# Altium project JlinkSwitch.PrjPcb
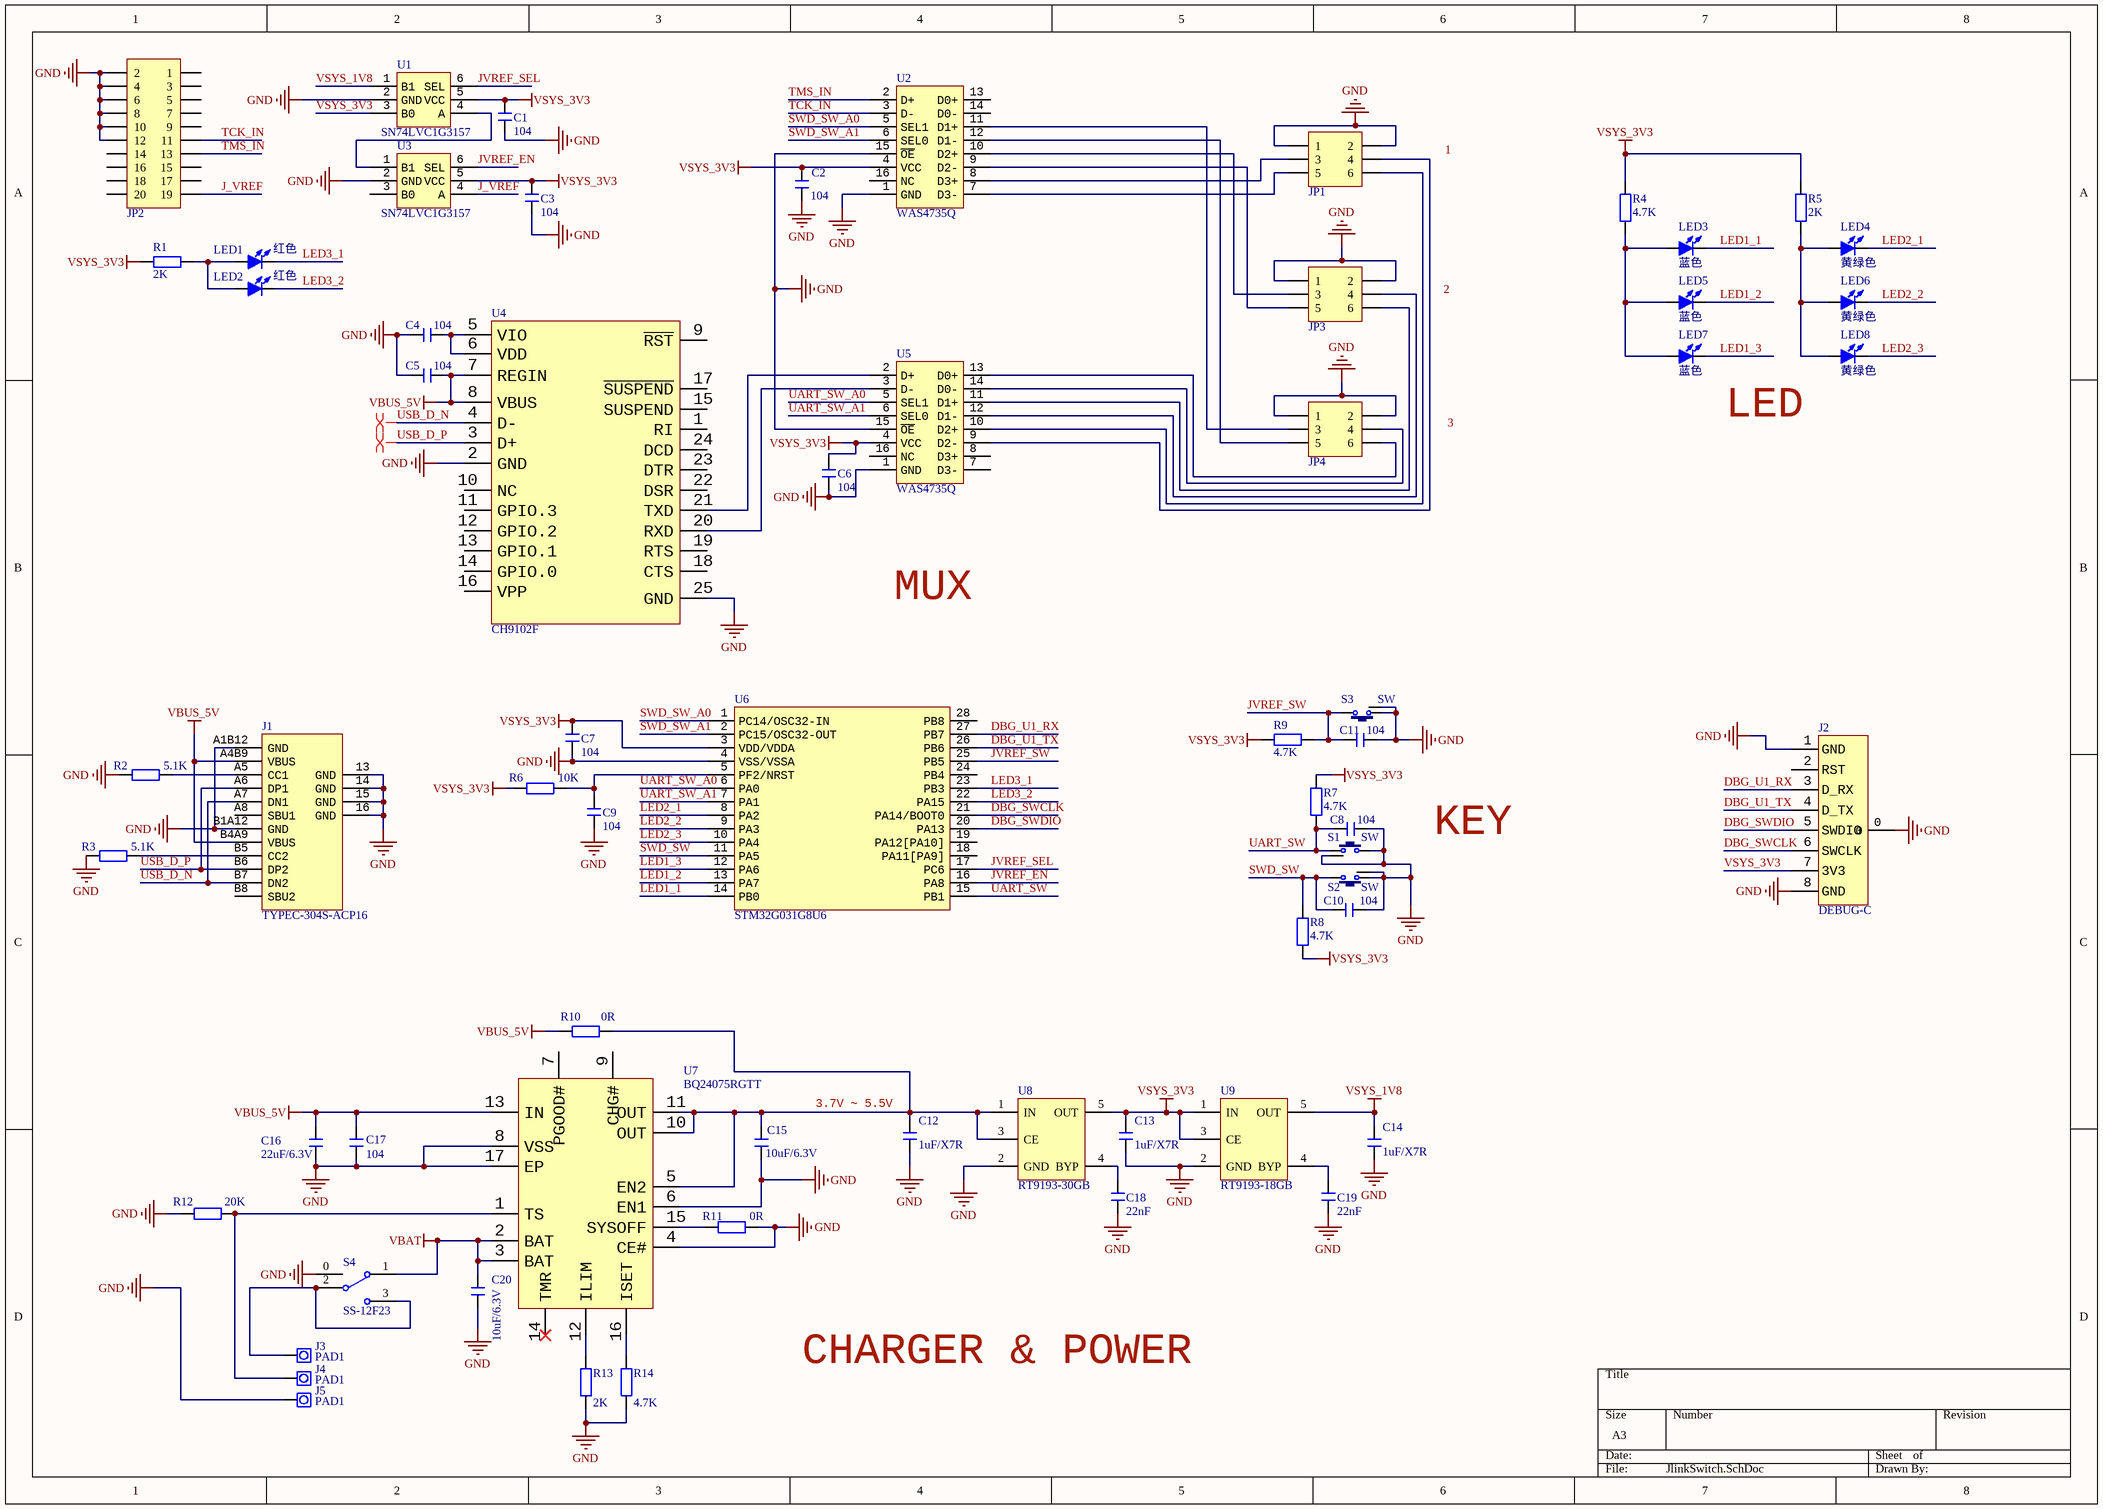
[diagram p0: JlinkSwitch.SchDoc]
1 sheet, 64 parts. Net scope: global (net labels, ports and power ports of the same name join across sheets).
Board file: JlinkSwitch.PcbDoc

## Sheet JlinkSwitch.SchDoc
size A3; SheetNumber: 1; SheetTotal: 1

### Parts
C1  104  [C 0402_L]
C2  104  [C 0402_L]
C3  104  [C 0402_L]
C4  104  [C 0402_L]
C5  104  [C 0402_L]
C6  104  [C 0402_L]
C7  104  [C 0402_L]
C8  104  [C 0402_L]
C9  104  [C 0402_L]
C10  104  [C 0402_L]
C11  104  [C 0402_L]
C12  1uF/X7R  [C 0402_L]
C13  1uF/X7R  [C 0402_L]
C14  1uF/X7R  [C 0402_L]
C15  10uF/6.3V  [C 0603_L]
C16  22uF/6.3V  [C 0603_L]
C17  104  [C 0402_L]
C18  22nF  [C 0402_L]
C19  22nF  [C 0402_L]
C20  10uF/6.3V  [C 0603_L]
J1  TYPEC-304S-ACP16  [USBC-16P-卧插]
J2  DEBUG-C  [FPC0.5 1H-WS-8P-NARROW]
J3  PAD1  [PAD]
J4  PAD1  [PAD]
J5  PAD1  [PAD]
JP1  Header3X2  [HDR2.54-LI-2X3P-侧贴]  (value not drawn)
JP2  Header 2X10  [HDR2.54-LI-M-2X10P-侧贴]  (value not drawn)
JP3  Header3X2  [HDR2.54-LI-2X3P-侧贴]  (value not drawn)
JP4  Header3X2  [HDR2.54-LI-2X3P-侧贴]  (value not drawn)
LED1  红色  [LED 0402R]
LED2  红色  [LED 0402R]
LED3  蓝色  [LED 0402R]
LED4  黄绿色  [LED 0402R]
LED5  蓝色  [LED 0402R]
LED6  黄绿色  [LED 0402R]
LED7  蓝色  [LED 0402R]
LED8  黄绿色  [LED 0402R]
R1  2K  [R 0402_L]
R2  5.1K  [R 0402_L]
R3  5.1K  [R 0402_L]
R4  4.7K  [R 0402_L]
R5  2K  [R 0402_L]
R6  10K  [R 0402_L]
R7  4.7K  [R 0402_L]
R8  4.7K  [R 0402_L]
R9  4.7K  [R 0402_L]
R10  0R  [R 0603_L]
R11  0R  [R 0402_L]
R12  20K  [R 0402_L]
R13  2K  [R 0402_L]
R14  4.7K  [R 0402_L]
S1  SW  [TS 2*4*3.5]
S2  SW  [TS 2*4*3.5]
S3  SW  [TS 2*4*3.5]
S4  SS-12F23  [MSK-12C01-07]
U1  SN74LVC1G3157  [SC70-6]
U2  WAS4735Q  [QFN16-1826]
U3  SN74LVC1G3157  [SC70-6]
U4  CH9102F  [QFN24 4x4_L]
U5  WAS4735Q  [QFN16-1826]
U6  STM32G031G8U6  [UFQFPN-28 4X4]
U7  BQ24075RGTT  [VQFN-16-EP(3X3)]
U8  RT9193-30GB  [SOT23-5]
U9  RT9193-18GB  [SOT23-5]

### Nets
GND: C1.2 C2.1 C3.2 C4.2 C5.2 C6.1 C7.2 C8.2 C9.2 C10.2 C11.2 C12.1 C13.1 C14.1 C15.1 C16.1 C17.1 C18.1 C19.1 C20.1 J1.13(GND) J1.14(GND) J1.15(GND) J1.16(GND) J1.A1B12(GND) J1.B1A12(GND) J2.0 J2.1(GND) J2.8(GND) J5.1 JP1.1 JP1.2 JP2.2 JP2.4 JP2.6 JP2.8 JP2.10 JP2.12 JP3.1 JP3.2 JP4.1 JP4.2 R2.1 R3.1 R11.1 R12.1 R13.1 R14.1 S1.0 S1.2 S2.0 S2.1 S3.0 S3.1 S4.0 U1.2(GND) U2.1(GND) U2.15(~{OE}) U3.2(GND) U4.2(GND) U4.25(GND) U5.1(GND) U5.15(~{OE}) U6.4(VSS/VSSA) U7.4(CE#) U7.6(EN1) U7.8(VSS) U7.17(EP) U8.2(GND) U9.2(GND)
VBAT: C20.2 S4.1 U7.2(BAT) U7.3(BAT)
VBUS_5V: C5.1 C16.2 C17.2 J1.A4B9(VBUS) J1.B4A9(VBUS) R10.1 U4.7(REGIN) U4.8(VBUS) U7.13(IN)
VSYS_1V8: C14.2 U1.1(B1) U9.5(OUT)
VSYS_3V3: C1.1 C2.2 C3.1 C6.2 C7.1 C13.2 J2.7(3V3) R1.2 R4.2 R5.2 R6.1 R7.2 R8.1 R9.2 U1.3(B0) U1.5(VCC) U2.4(VCC) U3.5(VCC) U5.4(VCC) U6.3(VDD/VDDA) U8.5(OUT) U9.1(IN) U9.3(CE)
DBG_SWCLK: J2.6(SWCLK) U6.21(PA14/BOOT0)
DBG_SWDIO: J2.5(SWDIO) U6.20(PA13)
DBG_U1_RX: J2.3(D_RX) U6.27(PB7)
DBG_U1_TX: J2.4(D_TX) U6.26(PB6)
J_VREF: JP2.19 U3.4(A)
JVREF_EN: U3.6(SEL) U6.16(PA8)
JVREF_SEL: U1.6(SEL) U6.17(PC6)
JVREF_SW: C11.1 R9.1 S3.2 U6.25(PB5)
LED1_1: LED3.1(K) U6.14(PB0)
LED1_2: LED5.1(K) U6.13(PA7)
LED1_3: LED7.1(K) U6.12(PA6)
LED2_1: LED4.1(K) U6.8(PA2)
LED2_2: LED6.1(K) U6.9(PA3)
LED2_3: LED8.1(K) U6.10(PA4)
LED3_1: LED1.1(K) U6.23(PB3)
LED3_2: LED2.1(K) U6.22(PA15)
SWD_SW: C10.1 R8.2 S2.2 U6.11(PA5)
SWD_SW_A0: U2.5(SEL1) U6.1(PC14/OSC32-IN)
SWD_SW_A1: U2.6(SEL0) U6.2(PC15/OSC32-OUT)
TCK_IN: JP2.11 U2.3(D-)
TMS_IN: JP2.13 U2.2(D+)
UART_SW: C8.1 R7.1 S1.1 U6.15(PB1)
UART_SW_A0: U5.5(SEL1) U6.6(PA0)
UART_SW_A1: U5.6(SEL0) U6.7(PA1)
USB_D_N: J1.A7(DN1) J1.B7(DN2) U4.4(D-)
USB_D_P: J1.A6(DP1) J1.B6(DP2) U4.3(D+)
NetC4_1: C4.1 U4.5(VIO) U4.6(VDD)
NetC9_1: C9.1 R6.2 U6.5(PF2/NRST)
NetC12_2: C12.2 C15.2 R10.2 U7.5(EN2) U7.10(OUT) U7.11(OUT) U8.1(IN) U8.3(CE)
NetC18_2: C18.2 U8.4(BYP)
NetC19_2: C19.2 U9.4(BYP)
NetJ1_A5: J1.A5(CC1) R2.2
NetJ1_B5: J1.B5(CC2) R3.2
NetJ3_1: J3.1 S4.2 S4.3
NetJ4_1: J4.1 R12.2 U7.1(TS)
NetJP1_3: JP1.3 U2.8(D3+)
NetJP1_4: JP1.4 U5.9(D2-)
NetJP1_5: JP1.5 U2.7(D3-)
NetJP1_6: JP1.6 U5.10(D2+)
NetJP3_3: JP3.3 U2.10(D2+)
NetJP3_4: JP3.4 U5.12(D1-)
NetJP3_5: JP3.5 U2.9(D2-)
NetJP3_6: JP3.6 U5.11(D1+)
NetJP4_3: JP4.3 U2.11(D1+)
NetJP4_4: JP4.4 U5.14(D0-)
NetJP4_5: JP4.5 U2.12(D1-)
NetJP4_6: JP4.6 U5.13(D0+)
NetLED1_2: LED1.2(A) LED2.2(A) R1.1
NetLED3_2: LED3.2(A) LED5.2(A) LED7.2(A) R4.1
NetLED4_2: LED4.2(A) LED6.2(A) LED8.2(A) R5.1
NetR11_2: R11.2 U7.15(SYSOFF)
NetR13_2: R13.2 U7.12(ILIM)
NetR14_2: R14.2 U7.16(ISET)
NetU1_4: U1.4(A) U3.1(B1)
NetU4_20: U4.20(RXD) U5.3(D-)
NetU4_21: U4.21(TXD) U5.2(D+)

Not connected (* = marked no-connect by the designer): J1 A8(SBU1) B8(SBU2); J2 2(RST); JP2 1 3 5 7 9 14 15 16 17 18 20; U2 13(D0+) 14(D0-) 16(NC); U3 3(B0); U4 1(RI) 9(~{RST}) 10(NC) 11(GPIO.3) 12(GPIO.2) 13(GPIO.1) 14(GPIO.0) 15(SUSPEND) 16(VPP) 17(~{SUSPEND}) 18(CTS) 19(RTS) 22(DSR) 23(DTR) 24(DCD); U5 7(D3-) 8(D3+) 16(NC); U6 18(PA11[PA9]) 19(PA12[PA10]) 24(PB4) 28(PB8); U7 7(PGOOD#) 9(CHG#) 14(TMR)*

### Layout directives
differential pair: USB_D_N, USB_D_P

### Notes on the sheet
- 1
- 2
- 3
- LED
- MUX
- KEY
- (near C12) 3.7V ~ 5.5V
- CHARGER & POWER

### Library data of the parts
C1-C20 = C: 无极性贴片电容; 版权归属: 源创客; BOM名称: 无极性贴片电容; 学习资源: www.ooocke.com
J1 = USB-C/16P: TYPEC母座16P
J2 = DEBUG-C: 带RST的调试接口
J3-J5 = PAD1: 引线焊盘
JP1 JP3 JP4 = Header 3X2: 3*2P接插件; 版权归属: 源创客; BOM名称: 3*2P接插件; 学习资源: www.ooocke.com
JP2 = Header 10X2: 10*2P接插件; 版权归属: 源创客; BOM名称: 10*2P接插件; 学习资源: www.ooocke.com
LED1-LED8 = LED-SMD: 贴片LED; 版权归属: 源创客; BOM名称: 贴片LED; 学习资源: www.ooocke.com
R1-R14 = R: 贴片电阻; 版权归属: 源创客; BOM名称: 贴片电阻; 学习资源: www.ooocke.com
S1-S3 = TSW: 侧按 按键开关单刀单掷
S4 = SSW-1P: 1路波动开关; BOM名称: 波动开关; 版权归属: 源创客; 学习资源: www.ooocke.com
U1 U3 = SN74LVC1G3157DCKR: SPDT 7Ω
U2 U5 = WAS4735Q: 模拟开关/多路复用器
U4 = CH9102F: USB转串口芯片
U6 = STM32G031G8U6: M0单片机 QFPN28
U7 = BQ24075RGTx: 单节1.5A线性电池充电 / 电源路径管理 5.5Vout
U8 U9 = XC6210B332MR: 低功耗LDO Id=35uA